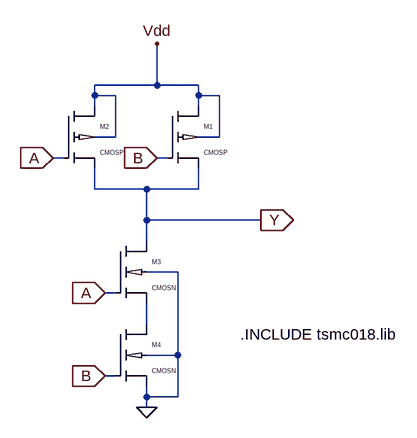
[diagram p0: schematic NAND2.asc]
NAND2.asc, the LTspice schematic file:
Version 4
SHEET 1 880 680
WIRE 320 16 320 -48
WIRE 320 16 224 16
WIRE 384 16 320 16
WIRE 224 32 224 16
WIRE 256 32 224 32
WIRE 384 32 384 16
WIRE 416 32 384 32
WIRE 224 48 224 32
WIRE 384 48 384 32
WIRE 256 96 256 32
WIRE 256 96 224 96
WIRE 416 96 416 32
WIRE 416 96 384 96
WIRE 176 128 160 128
WIRE 336 128 320 128
WIRE 224 176 224 144
WIRE 304 176 224 176
WIRE 384 176 384 144
WIRE 384 176 304 176
WIRE 304 224 304 176
WIRE 480 224 304 224
WIRE 304 256 304 224
WIRE 352 304 304 304
WIRE 256 336 240 336
WIRE 304 384 304 352
WIRE 352 432 352 304
WIRE 352 432 304 432
WIRE 256 464 240 464
WIRE 304 496 304 480
WIRE 352 496 352 432
WIRE 352 496 304 496
WIRE 304 512 304 496
FLAG 304 512 0
FLAG 160 128 A
IOPIN 160 128 In
FLAG 240 336 A
IOPIN 240 336 In
FLAG 320 128 B
IOPIN 320 128 In
FLAG 240 464 B
IOPIN 240 464 In
FLAG 480 224 Y
IOPIN 480 224 Out
FLAG 320 -48 Vdd
SYMBOL Pcmos 336 48 R0
SYMATTR InstName M1
SYMBOL Pcmos 176 48 R0
SYMATTR InstName M2
SYMBOL Ncmos 256 256 R0
SYMATTR InstName M3
SYMBOL Ncmos 256 384 R0
SYMATTR InstName M4
TEXT 448 400 Left 2 !.INCLUDE tsmc018.lib

The netlist it stands for:
* NAND2.asc
M1 Vdd B Y Vdd CMOSP
M2 Vdd A Y Vdd CMOSP
M3 Y A N001 0 CMOSN
M4 N001 B 0 0 CMOSN
.model NMOS NMOS
.model PMOS PMOS
.lib standard.mos
.INCLUDE tsmc018.lib
.lib tsmc018.lib
.backanno
.end